# Altium schematic sheet [9] Mechanical.SchDoc: =DocumentName
size A3; ENG_APP_DATE: --/--/--; DSN_APP_DATE: --/--/--; CHK_APP_DATE: --/--/--; Organization: ORGANIZATION; Address1: R. Aprígio Veloso, 882, Universitário; Address2: Campina Grande - PB; Address3: 58429-900; DocumentNumber: 9; Revision: -; SheetNumber: 9; SheetTotal: 9; ENG_DATE: --/--/--; DSN_DATE: --/--/--; CHK_DATE: --/--/--; SCH_SCALE: 1:1
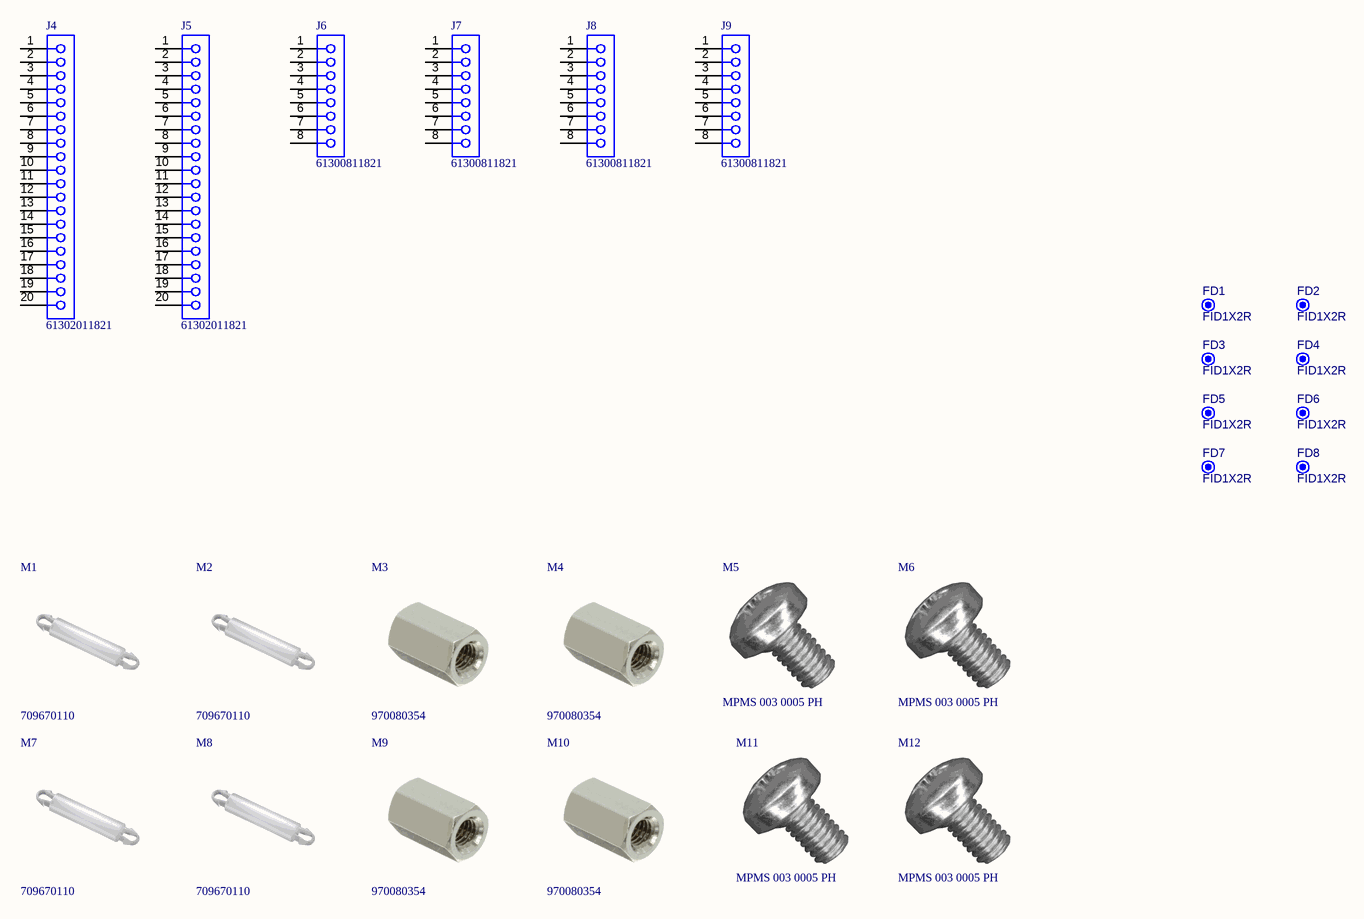
[diagram p0: [9] Mechanical.SchDoc]

## Parts
FD1  FID1X2R  [FID1X2R]  (no BOM)
FD2  FID1X2R  [FID1X2R]  (no BOM)
FD3  FID1X2R  [FID1X2R]  (no BOM)
FD4  FID1X2R  [FID1X2R]  (no BOM)
FD5  FID1X2R  [FID1X2R]  (no BOM)
FD6  FID1X2R  [FID1X2R]  (no BOM)
FD7  FID1X2R  [FID1X2R]  (no BOM)
FD8  FID1X2R  [FID1X2R]  (no BOM)
J4  61302011821  [61302011821]  (mechanical)
J5  61302011821  [61302011821]  (mechanical)
J6  61300811821  [61300811821]  (mechanical)
J7  61300811821  [61300811821]  (mechanical)
J8  61300811821  [61300811821]  (mechanical)
J9  61300811821  [61300811821]  (mechanical)
M1  709670110  (mechanical)
M2  709670110  (mechanical)
M3  970080354  (mechanical)
M4  970080354  (mechanical)
M5  MPMS 003 0005 PH  (mechanical)
M6  MPMS 003 0005 PH  (mechanical)
M7  709670110  (mechanical)
M8  709670110  (mechanical)
M9  970080354  (mechanical)
M10  970080354  (mechanical)
M11  MPMS 003 0005 PH  (mechanical)
M12  MPMS 003 0005 PH  (mechanical)

## Nets

Not connected (* = marked no-connect by the designer): J4 1 2 3 4 5 6 7 8 9 10 11 12 13 14 15 16 17 18 19 20; J5 1 2 3 4 5 6 7 8 9 10 11 12 13 14 15 16 17 18 19 20; J6 1 2 3 4 5 6 7 8; J7 1 2 3 4 5 6 7 8; J8 1 2 3 4 5 6 7 8; J9 1 2 3 4 5 6 7 8

## Notes on the sheet
- REVISION
- DESCRIPTION
- DATE
- APPROVED
- ADDRESS
- PROJECT
- VERSION
- TITLE
- A3
- SIZE
- SCALE
- DOCUMENT NAME:
- DOCUMENT REVISION:
- OF
- SHEET:
- PROJECT REVISION:

## Library data of the parts
FD1-FD8 = CMP-00028-00005-5: Fiducial - Round 1x2mm; Pins: 0
J4 J5 = CMP-002-00074-1: THT Vertical Socket Header WR-PHD, Pitch 2.54 mm, Single Row, 20 pins; Contact Resistance: 20mR; Operating Supply Voltage: 250V; Current Rating: 3A; Gender: Female; Orientation: Vertical; Pins: 20; Lead Pitch: 2.54mm; RoHS Compliant: Yes
J6-J9 = CMP-002-00075-1: Btb Conn, Rcpt, 8Pos, 1Row, 2.54Mm Rohs Compliant: Yes; Operating Supply Voltage: 250V; Gender: Female; Contact Resistance: 20mR; Current Rating: 3A; Pins: 8; Lead Pitch: 2.54mm; Orientation: Vertical; RoHS Compliant: Yes
M1 M2 M7 M8 = CMP-00028-00009-2: Pcb Mounting, Nylon 6.6, 11Mm Rohs Compliant: Yes; Material: Nylon; Series: WA-SNSN
M3 M4 M9 M10 = CMP-00028-00008-4: WA-SBRII Brass Spacer Stud Metric Thread int./int.; Plating: Nickel; Thread Size: M3; Gender: Female, Female; Threaded/Unthreaded: Threaded; Material: Brass; Series: WA-SBRII; Color: Silver
M5 M6 M11 M12 = CMP-00028-00007-2: Mach Screw Pan Head Phillips M3; Lead Free: Contains Lead